# Altium schematic sheet BSPD_mod_0513.SchDoc (part 1 of 3)
size A4
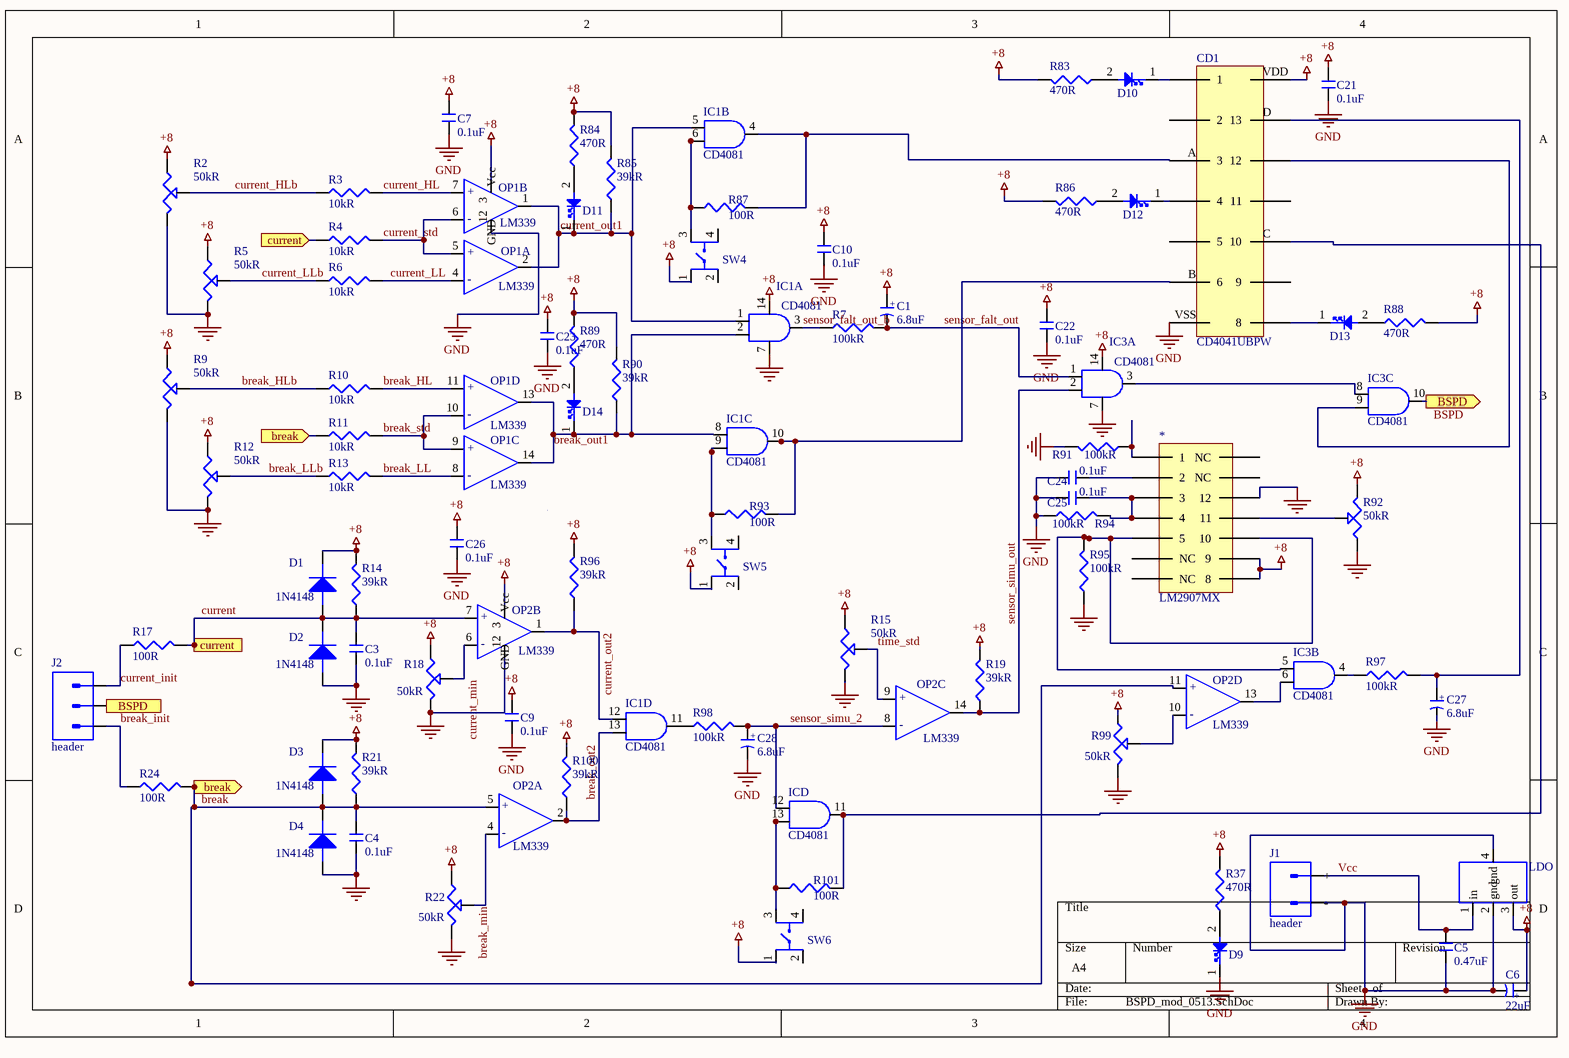
[diagram p0: BSPD_mod_0513.SchDoc]

## Parts
*  LM2907MX
C1  6.8uF  [2312-6.8uF-Capacitor]
C3  0.1uF  [0603-0.1uF-Capacitor]
C4  0.1uF  [0603-0.1uF-Capacitor]
C5  0.47uF  [0805-0.47uF-CAPACITOR]
C6  22uF  [0805-22uF-capacitor]
C7  0.1uF  [0603-0.1uF-Capacitor]
C9  0.1uF  [0603-0.1uF-Capacitor]
C10  0.1uF  [0603-0.1uF-Capacitor]
C21  0.1uF  [0603-0.1uF-Capacitor]
C22  0.1uF  [0603-0.1uF-Capacitor]
C23  0.1uF  [0603-0.1uF-Capacitor]
C24  0.1uF  [0603-0.1uF-Capacitor]
C25  0.1uF  [0603-0.1uF-Capacitor]
C26  0.1uF  [0603-0.1uF-Capacitor]
C27  6.8uF  [2312-6.8uF-Capacitor]
C28  6.8uF  [2312-6.8uF-Capacitor]
CD1  CD4041UBPW
D1  1N4148  [1N4148W-TP]
D2  1N4148  [1N4148W-TP]
D3  1N4148  [1N4148W-TP]
D4  1N4148  [1N4148W-TP]
D9  led-150080RS75000  [led-0805]  (value not drawn)
D10  led-150080RS75000  [led-0805]  (value not drawn)
D11  led-150080RS75000  [led-0805]  (value not drawn)
D12  led-150080RS75000  [led-0805]  (value not drawn)
D13  led-150080RS75000  [led-0805]  (value not drawn)
D14  led-150080RS75000  [led-0805]  (value not drawn)
IC  CD4081  [CD4081BM]  (part D of 4)
IC1  CD4081  [CD4081BM]  (parts A,B,C,D of 4)
IC3  CD4081  [CD4081BM]  (parts A,B,C of 4)
J1  header  [2pin-header]
J2  header  [3PIN-header]
LDO  LM2940IMPX-8.0/NOPB  [LM2940IMPX-8.0/NOPB]  (value not drawn)
OP1  LM339  [LM339ADR]  (parts A,B,C,D of 4)
OP2  LM339  [LM339ADR]  (parts A,B,C,D of 4)
R2  50kR  [50kR-vertical]
R3  10kR  [0805-Resistor]
R4  10kR  [0805-Resistor]
R5  50kR  [50kR-vertical]
R6  10kR  [0805-Resistor]
R7  100kR  [0805-Resistor]
R9  50kR  [50kR-vertical]
R10  10kR  [0805-Resistor]
R11  10kR  [0805-Resistor]
R12  50kR  [50kR-vertical]
R13  10kR  [0805-Resistor]
R14  39kR  [0805-Resistor]
R15  50kR  [50kR-vertical]
R17  100R  [0805-Resistor]
R18  50kR  [50kR-vertical]
R19  39kR  [0805-Resistor]
R21  39kR  [0805-Resistor]
R22  50kR  [50kR-vertical]
R24  100R  [0805-Resistor]
R37  470R  [0805-Resistor]
R83  470R  [0805-Resistor]
R84  470R  [0805-Resistor]
R85  39kR  [0805-Resistor]
R86  470R  [0805-Resistor]
R87  100R  [0805-Resistor]
R88  470R  [0805-Resistor]
R89  470R  [0805-Resistor]
R90  39kR  [0805-Resistor]
R91  100kR  [0805-Resistor]
R92  50kR  [50kR-vertical]
R93  100R  [0805-Resistor]
R94  100kR  [0805-Resistor]
R95  100kR  [0805-Resistor]
R96  39kR  [0805-Resistor]
R97  100kR  [0805-Resistor]
R98  100kR  [0805-Resistor]
R99  50kR  [50kR-vertical]
R100  39kR  [0805-Resistor]
R101  100R  [0805-Resistor]
SW4  (button)95C06A2T  [button-dip]  (value not drawn)
SW5  (button)95C06A2T  [button-dip]  (value not drawn)
SW6  (button)95C06A2T  [button-dip]  (value not drawn)

## Ports
break (in), break (out), BSPD (out), current (in), current (out)

## Nets
+8: *.8 *.9 C1.1(+) C6.1(+) C7.2 C9.2 C10.2 C21.2 C22.1 C23.2 C26.2 CD1.VDD D1.1(-) D3.1(-) IC1.14(Vcc) IC3.14(Vcc) LDO.3(out) OP1.3(Vcc) OP2.3(Vcc) R2.1 R5.1 R9.1 R12.1 R14.2 R15.1 R18.1 R19.2 R21.2 R22.1 R37.2 R83.2 R84.2 R85.2 R86.2 R88.2 R89.2 R90.2 R92.3 R99.1 SW4.1 SW5.1 SW6.1
GND: *.12 C3.1 C4.1 C5.1 C6.2(-) C7.1 C9.1 C10.1 C21.1 C22.2 C23.1 C24.2 C25.2 C26.1 C27.2(-) C28.2(-) CD1.VSS D2.2(+) D4.2(+) D9.1 IC1.7(GND) IC3.7(GND) J1.2(-) LDO.2(gnd) LDO.4(gnd) OP1.12(GND) OP2.12(GND) R2.3 R5.3 R9.3 R12.3 R15.3 R18.3 R22.3 R91.2 R92.1 R94.1 R95.1 R99.3
break: C4.2 D3.2(+) D4.1(-) OP2.5(+) OP2.11(+) R11.1 R21.1 R24.2 ; port break
break_HL: OP1.11(+) R10.2
break_HLb: R9.2 R10.1
break_init: J2.3 R24.1
break_LL: OP1.8(-) R13.2
break_LLb: R12.2 R13.1
break_min: OP2.4(-) R22.2
break_out1: D14.1 IC1.2(in) IC1.8(in) OP1.13(out) OP1.14(out) R90.1
break_out2: IC1.13(in) OP2.2(out) R100.1
break_std: OP1.9(+) OP1.10(-) R11.2
BSPD: IC3.10(out) J2.2 ; port BSPD
current: C3.2 D1.2(+) D2.1(-) OP2.7(+) R4.1 R14.1 R17.2 ; port current
current_HL: OP1.7(+) R3.2
current_HLb: R2.2 R3.1
current_init: J2.1 R17.1
current_LL: OP1.4(-) R6.2
current_LLb: R5.2 R6.1
current_min: OP2.6(-) R18.2
current_out1: D11.1 IC1.1(in) IC1.5(in) OP1.1(out) OP1.2(out) R85.1
current_out2: IC1.12(in) OP2.1(out) R96.1
current_std: OP1.5(+) OP1.6(-) R4.2
sensor_falt_out: C1.2(-) IC3.1(in) R7.2
sensor_falt_out_b: IC1.3(out) R7.1
sensor_simu_2: C28.1(+) IC.12(in) OP2.8(-) R98.2
sensor_simu_out: IC3.2(in) OP2.14(out) R19.1
time_std: OP2.9(+) R15.2
Vcc: C5.2 J1.1(+) LDO.1(in)
Net*_1: *.1 R91.1
Net*_2: *.2 C24.1
Net*_3: *.3 *.4 C25.1 R94.2
Net*_5: *.5 *.10 IC3.5(in) R95.2
Net*_11: *.11 R92.2
NetC27_1: C27.1(+) CD1.D(13) R97.2
NetCD1_1: CD1.1 D10.1
NetCD1_4: CD1.4 D12.1
NetCD1_8: CD1.8 D13.1
NetCD1_12: CD1.12 IC3.9(in)
NetCD1_A: CD1.A(3) IC1.4(out) R87.2
NetCD1_B: CD1.B(6) IC1.10(out) R93.2
NetCD1_C: CD1.C(10) IC.11(out) R101.2
NetD9_2: D9.2 R37.1
NetD10_2: D10.2 R83.1
NetD11_2: D11.2 R84.1
NetD12_2: D12.2 R86.1
NetD13_2: D13.2 R88.1
NetD14_2: D14.2 R89.1
NetIC1_6: IC1.6(in) R87.1 SW4.3
NetIC1_9: IC1.9(in) R93.1 SW5.3
NetIC1_11: IC1.11(out) R98.1
NetIC3_3: IC3.3(out) IC3.8(in)
NetIC3_4: IC3.4(out) R97.1
NetIC3_6: IC3.6(in) OP2.13(out)
NetIC_13: IC.13(in) R101.1 SW6.3
NetOP2_10: OP2.10(-) R99.2

Not connected (* = marked no-connect by the designer): * 6(NC) 7(NC) 13(NC) 14(NC); CD1 2 5 9 11; R96 2; R100 2; SW4 2 4; SW5 2 4; SW6 2 4

## Notes on the sheet
- Labels drawn without touching a wire or pin: +8, BSPD